# Altium schematic sheet ETH10M100_RJ45wMAGNET.SchDoc
size A3; SheetNumber: 16; SheetTotal: 27
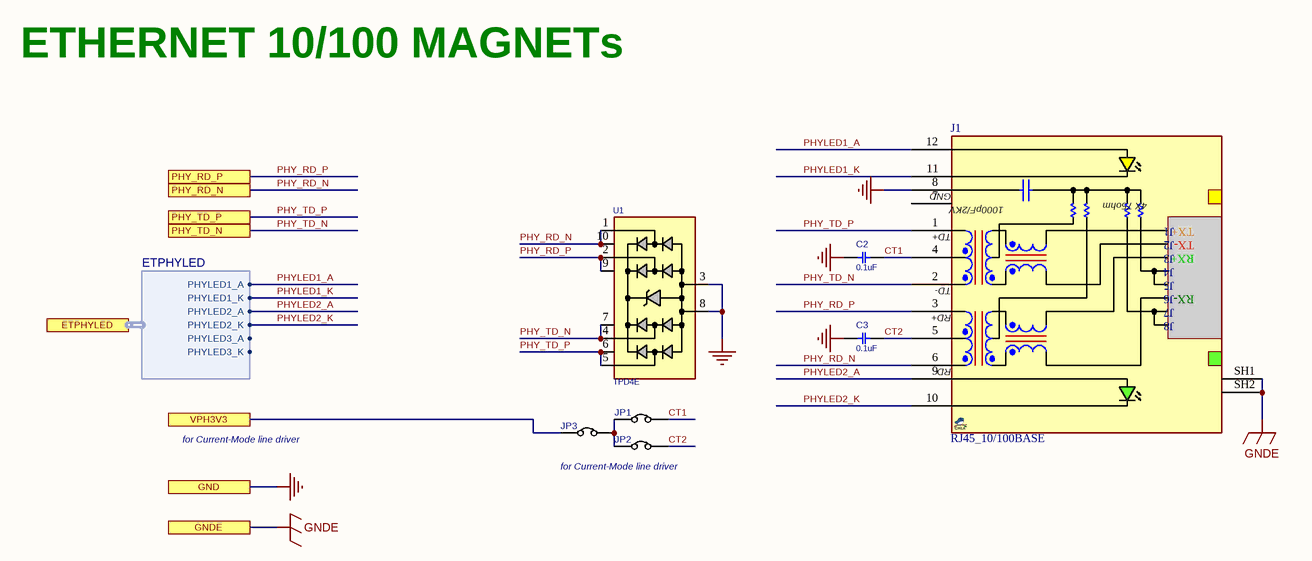
[diagram p0: ETH10M100_RJ45wMAGNET.SchDoc]

## Parts
C2  0.1uF  [C0402]
C3  0.1uF  [C0402]
J1  RJ45_10/100BASE  [RJ45_8M_HR911105A]
JP1  JMPSOLDER  [JP_30X50]  (value not drawn)
JP2  JMPSOLDER  [JP_30X50]  (value not drawn)
JP3  JMPSOLDER  [JP_30X50]  (value not drawn)
U1  TPD4E  [SON50_10_2510]

## Ports
ETPHYLED (harness ETPHYLED), GND, GNDE, PHY_RD_N, PHY_RD_P, PHY_TD_N, PHY_TD_P, VPH3V3

## Harnesses
ETPHYLED: PHYLED1_A, PHYLED1_K, PHYLED2_A, PHYLED2_K, PHYLED3_A, PHYLED3_K

## Nets
GND: C2.1 C3.1 J1.8(CHSGND) U1.3 U1.8 ; port GND
GNDE: J1.SH1 J1.SH2 ; port GNDE
CT1: C2.2 J1.4(TCT) JP1.2
CT2: C3.2 J1.5(RCT) JP2.2
PHY_RD_N: J1.6(RD-) U1.1 U1.10 ; port PHY_RD_N
PHY_RD_P: J1.3(RD+) U1.2 U1.9 ; port PHY_RD_P
PHY_TD_N: J1.2(TD-) U1.4 U1.7 ; port PHY_TD_N
PHY_TD_P: J1.1(TD+) U1.5 U1.6 ; port PHY_TD_P
PHYLED1_A: J1.12(YLED+) ; port ETPHYLED.PHYLED1_A
PHYLED1_K: J1.11(YLED-) ; port ETPHYLED.PHYLED1_K
PHYLED2_A: J1.9(GLED+) ; port ETPHYLED.PHYLED2_A
PHYLED2_K: J1.10(GLED-) ; port ETPHYLED.PHYLED2_K
VPH3V3: JP3.1 ; port VPH3V3
NetJP1_1: JP1.1 JP2.1 JP3.2

Not connected (* = marked no-connect by the designer): J1 7(NC)

## Notes on the sheet
- ETHERNET 10/100 MAGNETs
- for Current-Mode line driver
- (near JP2) for Current-Mode line driver
- (in symbol RJ45_HR911105A) GND; 4X 75ohm; 1000pF/2KV; TX+; J2; TX-; J3; RX+; J4; J5; J6; RX-; J7; J8

## Library data of the parts
C2 C3 = CAP_SMD_MLCC_22n50V: CAP, MLCC; PARAM2: 50V; MANF_P#: -; MANF: -; PARAM: -; DESC: -; VALUE: 0.1uF
J1 = RJ45_HR911105A: RJ45, 10/100BASE, G/Y LED; MANF: Hanrun; MANF_P#: HR911105A; PARAM2: 10/100BASE, G/Y LED; VALUE: RJ45_10/100BASE
JP1-JP3 = JUMPER_SOLDER: JUMPER, HEADER 2PIN; MANF: MANF; MANF_P#: MANF_P#; VALUE: JMPSOLDER
U1 = TVS_X4_TPD4E05U06: TVS, ESD PROTECT, 4CH,; MANF_P#: TPD4E05U06DQA; MANF: Texas Instruments; PARAM2: 6.5Vbr, 0.4pF, –40°~125°C; PARAM: ±12-kV ContactD, ±15-kVAirD; PRICE: 0.6$; VALUE: TPD4E